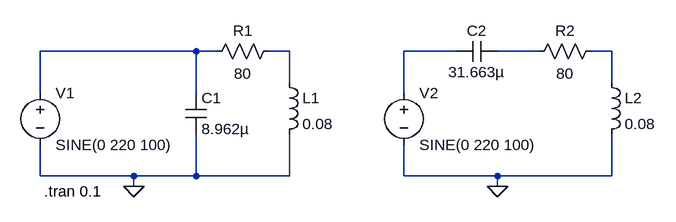
[diagram p0: schematic 1-phase_Compensation_Capacitor.asc]
1-phase_Compensation_Capacitor.asc, the LTspice schematic file:
Version 4
SHEET 1 1068 680
WIRE 288 80 48 80
WIRE 320 80 288 80
WIRE 432 80 400 80
WIRE 688 80 608 80
WIRE 816 80 752 80
WIRE 928 80 896 80
WIRE 432 128 432 80
WIRE 928 128 928 80
WIRE 48 144 48 80
WIRE 288 144 288 80
WIRE 608 144 608 80
WIRE 48 272 48 224
WIRE 192 272 48 272
WIRE 288 272 288 208
WIRE 288 272 192 272
WIRE 432 272 432 208
WIRE 432 272 288 272
WIRE 608 272 608 224
WIRE 752 272 608 272
WIRE 928 272 928 208
WIRE 928 272 752 272
WIRE 192 288 192 272
WIRE 752 288 752 272
FLAG 192 288 0
FLAG 752 288 0
SYMBOL voltage 48 128 R0
WINDOW 123 0 0 Left 0
WINDOW 39 0 0 Left 0
SYMATTR InstName V1
SYMATTR Value SINE(0 220 100)
SYMBOL res 304 96 R270
WINDOW 0 32 56 VTop 2
WINDOW 3 -3 56 VBottom 2
SYMATTR InstName R1
SYMATTR Value 80
SYMBOL ind 416 112 R0
SYMATTR InstName L1
SYMATTR Value 0.08
SYMBOL cap 272 144 R0
SYMATTR InstName C1
SYMATTR Value 8.962µ
SYMBOL voltage 608 128 R0
WINDOW 123 0 0 Left 0
WINDOW 39 0 0 Left 0
SYMATTR InstName V2
SYMATTR Value SINE(0 220 100)
SYMBOL res 800 96 R270
WINDOW 0 32 56 VTop 2
WINDOW 3 -3 56 VBottom 2
SYMATTR InstName R2
SYMATTR Value 80
SYMBOL ind 912 112 R0
SYMATTR InstName L2
SYMATTR Value 0.08
SYMBOL cap 688 96 R270
WINDOW 0 32 32 VTop 2
WINDOW 3 0 32 VBottom 2
SYMATTR InstName C2
SYMATTR Value 31.663µ
TEXT 54 296 Left 2 !.tran 0.1

The netlist it stands for:
* 1-phase_Compensation_Capacitor.asc
V1 N001 0 SINE(0 220 100)
R1 N001 N002 80
L1 N002 0 0.08
C1 N001 0 8.962µ
V2 N003 0 SINE(0 220 100)
R2 N004 N005 80
L2 N005 0 0.08
C2 N003 N004 31.663µ
.tran 0.1
.backanno
.end